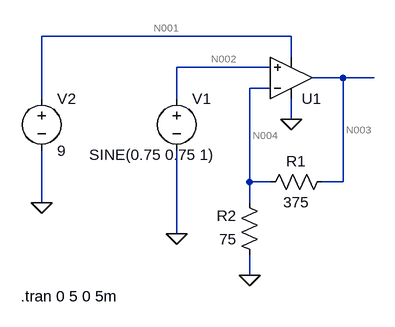
[diagram p0: schematic Draft1.asc]
Draft1.asc, the LTspice schematic file:
Version 4.1
SHEET 1 880 680
WIRE 224 -496 -160 -496
WIRE 224 -464 224 -496
WIRE 192 -448 48 -448
WIRE 304 -432 256 -432
WIRE 352 -432 304 -432
WIRE 192 -416 160 -416
WIRE -160 -400 -160 -496
WIRE 48 -400 48 -448
WIRE 224 -368 224 -400
WIRE 160 -272 160 -416
WIRE 192 -272 160 -272
WIRE 304 -272 304 -432
WIRE 304 -272 272 -272
WIRE -160 -240 -160 -320
WIRE 160 -240 160 -272
WIRE 48 -192 48 -320
WIRE 160 -128 160 -160
FLAG 160 -128 0
FLAG 48 -192 0
FLAG 224 -368 0
FLAG -160 -240 0
SYMBOL OpAmps\\UniversalOpAmp 224 -432 M180
SYMATTR InstName U1
SYMBOL res 288 -288 R90
WINDOW 0 0 56 VBottom 2
WINDOW 3 32 56 VTop 2
SYMATTR InstName R1
SYMATTR Value 375
SYMBOL res 176 -144 R180
WINDOW 0 36 76 Left 2
WINDOW 3 36 40 Left 2
SYMATTR InstName R2
SYMATTR Value 75
SYMBOL voltage 48 -416 R0
WINDOW 3 -135 102 Left 2
WINDOW 123 0 0 Left 0
WINDOW 39 0 0 Left 0
SYMATTR InstName V1
SYMATTR Value SINE(0.75 0.75 1)
SYMBOL voltage -160 -416 R0
WINDOW 123 0 0 Left 0
WINDOW 39 0 0 Left 0
SYMATTR InstName V2
SYMATTR Value 9
TEXT -192 -96 Left 2 !.tran 0 5 0 5m

The netlist it stands for:
* Draft1.asc
X§U1 N002 N004 0 N001 N003 level1 Avol=1Meg GBW=10Meg Vos=0 En=0 Enk=0 In=0 Ink=0 Rin=500Meg  ; pins In+ In- V+ V- OUT
R1 N003 N004 375
R2 0 N004 75
V1 N002 0 SINE(0.75 0.75 1)
V2 N001 0 9
.tran 0 5 0 5m
.lib UniversalOpAmp1.lib
.backanno
.end

* Results of the author's LTspice run, read from the files saved beside the schematic
* Operating Point, zero values left out:
*   V(n004) = 750 mV
*   V(n003) = 4.5 V
*   V(n002) = 750 mV
*   V(n001) = 9 V
*   I(V1) = 7.5 nA
*   I(R1) = 10 mA
*   I(R2) = -10 mA
*   I(V2) = -16.5 nA
*   Ix(u1:1) = -7.5 nA
*   Ix(u1:2) = -7.5 nA
*   Ix(u1:3) = -1.5 nA
*   Ix(u1:4) = 16.5 nA
*   Ix(u1:5) = -10 mA
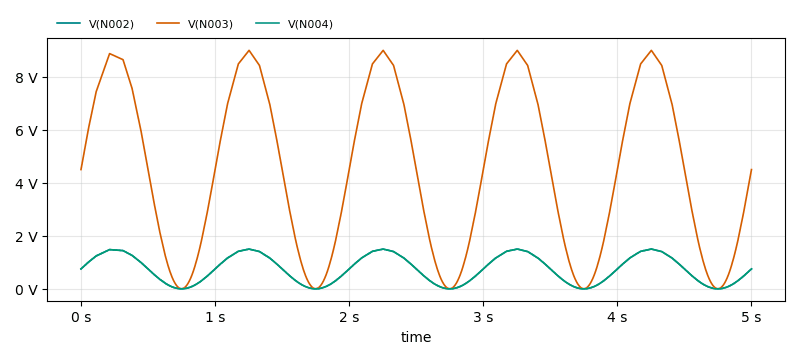
[diagram p1: Transient Analysis of Draft1.asc, plotted from the saved traces]
* Transient Analysis, 1 run:
*   V(N002): min 38.44 µV, max 1.5 V, average 745.5 mV, rms 914.6 mV, last 750 mV
*   V(N003): min 227.3 µV, max 8.999 V, average 4.473 V, rms 5.487 V, last 4.5 V
*   V(N004): min 38.44 µV, max 1.5 V, average 745.5 mV, rms 914.6 mV, last 750 mV